# Altium schematic sheet CH3_CH4.SchDoc
size A4; SheetNumber: 3; SheetTotal: 5
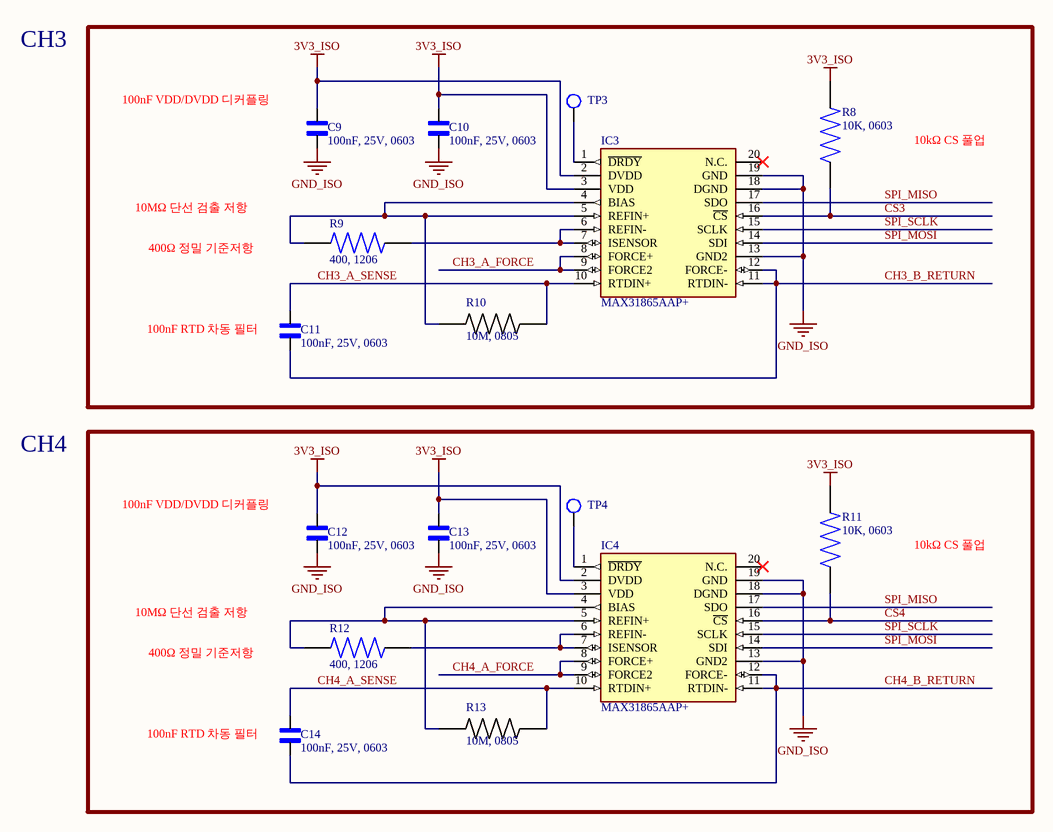
[diagram p0: CH3_CH4.SchDoc]

## Parts
C9  100nF, 25V, 0603  [CAPC1608X90N]
C10  100nF, 25V, 0603  [CAPC1608X90N]
C11  100nF, 25V, 0603  [CAPC1608X90N]
C12  100nF, 25V, 0603  [CAPC1608X90N]
C13  100nF, 25V, 0603  [CAPC1608X90N]
C14  100nF, 25V, 0603  [CAPC1608X90N]
IC3  MAX31865AAP+  [SOP65P778X199-20N]
IC4  MAX31865AAP+  [SOP65P778X199-20N]
R8  10K, 0603  [RESC1607X60N]
R9  400, 1206  [RESC3116X65N]
R10  10M, 0805  [*RESC2012X60N]
R11  10K, 0603  [RESC1607X60N]
R12  400, 1206  [RESC3116X65N]
R13  10M, 0805  [*RESC2012X60N]
TP3  TEST POINT  [TESTPOINT]  (value not drawn)
TP4  TEST POINT  [TESTPOINT]  (value not drawn)

## Nets
3V3_ISO: C9.2 C10.2 C12.2 C13.2 IC3.2(DVDD) IC3.3(VDD) IC4.2(DVDD) IC4.3(VDD) R8.2 R11.2
GND_ISO: C9.1 C10.1 C12.1 C13.1 IC3.13(GND2) IC3.18(DGND) IC3.19(GND) IC4.13(GND2) IC4.18(DGND) IC4.19(GND)
CH3_A_FORCE: IC3.8(FORCE+) IC3.9(FORCE2)
CH3_A_SENSE: C11.2 IC3.10(RTDIN+) R10.2
CH3_B_RETURN: C11.1 IC3.11(RTDIN-) IC3.12(FORCE-)
CH4_A_FORCE: IC4.8(FORCE+) IC4.9(FORCE2)
CH4_A_SENSE: C14.2 IC4.10(RTDIN+) R13.2
CH4_B_RETURN: C14.1 IC4.11(RTDIN-) IC4.12(FORCE-)
CS3: IC3.16(~{CS}) R8.1
CS4: IC4.16(~{CS}) R11.1
SPI_MISO: IC3.17(SDO) IC4.17(SDO)
SPI_MOSI: IC3.14(SDI) IC4.14(SDI)
SPI_SCLK: IC3.15(SCLK) IC4.15(SCLK)
NetIC3_1: IC3.1(~{DRDY}) TP3.1
NetIC3_4: IC3.4(BIAS) IC3.5(REFIN+) R9.1 R10.1
NetIC3_6: IC3.6(REFIN-) IC3.7(ISENSOR) R9.2
NetIC4_1: IC4.1(~{DRDY}) TP4.1
NetIC4_4: IC4.4(BIAS) IC4.5(REFIN+) R12.1 R13.1
NetIC4_6: IC4.6(REFIN-) IC4.7(ISENSOR) R12.2

Not connected (* = marked no-connect by the designer): IC3 20(N.C.)*; IC4 20(N.C.)*

## Notes on the sheet
- CH3
- (near C9) 100nF VDD/DVDD 디커플링
- 10kΩ CS 풀업
- 10MΩ 단선 검출 저항
- 400Ω 정밀 기준저항
- (near C11) 100nF RTD 차동 필터
- CH4
- (near C12) 100nF VDD/DVDD 디커플링
- (near C14) 100nF RTD 차동 필터

## Library data of the parts
C9-C14 = CL10B104KA8VPJC: Multilayer Ceramic Capacitors MLCC - SMD/SMT; MF: Samsung Electro-Mechanics; SnapEDA_Link: https://www.snapeda.com/parts/CL10B104KA8VPJC/Samsung/view-part/?ref=snap; Package: SMD-2 Samsung; Value: *; MP: CL10B104KA8VPJC; Check_prices: https://www.snapeda.com/parts/CL10B104KA8VPJC/Samsung/view-part/?ref=eda
IC3 IC4 = MAX31865AAP+: Integrated Circuit; Manufacturer_Name: Analog Devices; Datasheet Link: https://www.analog.com/MAX31865/datasheet; Height: 1.99mm; Manufacturer_Part_Number: MAX31865AAP+; Mouser Part Number: 700-MAX31865AAP+; Mouser Price/Stock: https://www.mouser.co.uk/ProductDetail/Analog-Devices-Maxim-Integrated/MAX31865AAP%2b?qs=PVVDbbWpW3IB0xqHe0DjLw%3D%3D; Arrow Part Number: MAX31865AAP+; Arrow Price/Stock: https://www.arrow.com/en/products/max31865aap/analog-devices.html?utm_currency=USD&region=europe
R8 R11 = RC0603FR-0710KL: 10 kOhms ±1% 0.1W, 1/10W Chip Resistor 0603 (1608 Metric) Moisture Resistant Thick Film; MF: Yageo Corporation; MP: RC0603FR0710KL; SnapEDA_Link: https://www.snapeda.com/parts/RC0603FR0710KL/Yageo/view-part/?ref=snap; Package: 0603-2 YAGEO; Value: *; Check_prices: https://www.snapeda.com/parts/RC0603FR0710KL/Yageo/view-part/?ref=eda
R9 R12 = RT1206BRD07400RL: 400 Ohms Â±0.1% 0.25W, 1/4W Chip Resistor 1206 (3216 Metric) - Thin Film; MF: Yageo; SnapEDA_Link: https://www.snapeda.com/parts/RT1206BRD07400RL/Yageo/view-part/?ref=snap; Package: 3116 Yageo; Value: *; MP: RT1206BRD07400RL; Check_prices: https://www.snapeda.com/parts/RT1206BRD07400RL/Yageo/view-part/?ref=eda
R10 R13 = AC0805FR-1010ML: 10MΩ, ±1%, 125mW, 0805, AEC-Q200; SnapEDA_Link: https://www.snapeda.com/parts/AC0805FR-1010ML/Yageo/view-part/?ref=snap; Check_prices: https://www.snapeda.com/parts/AC0805FR-1010ML/Yageo/view-part/?ref=eda; Value: *